# EAGLE schematic filter (EAGLE 8.6.0)
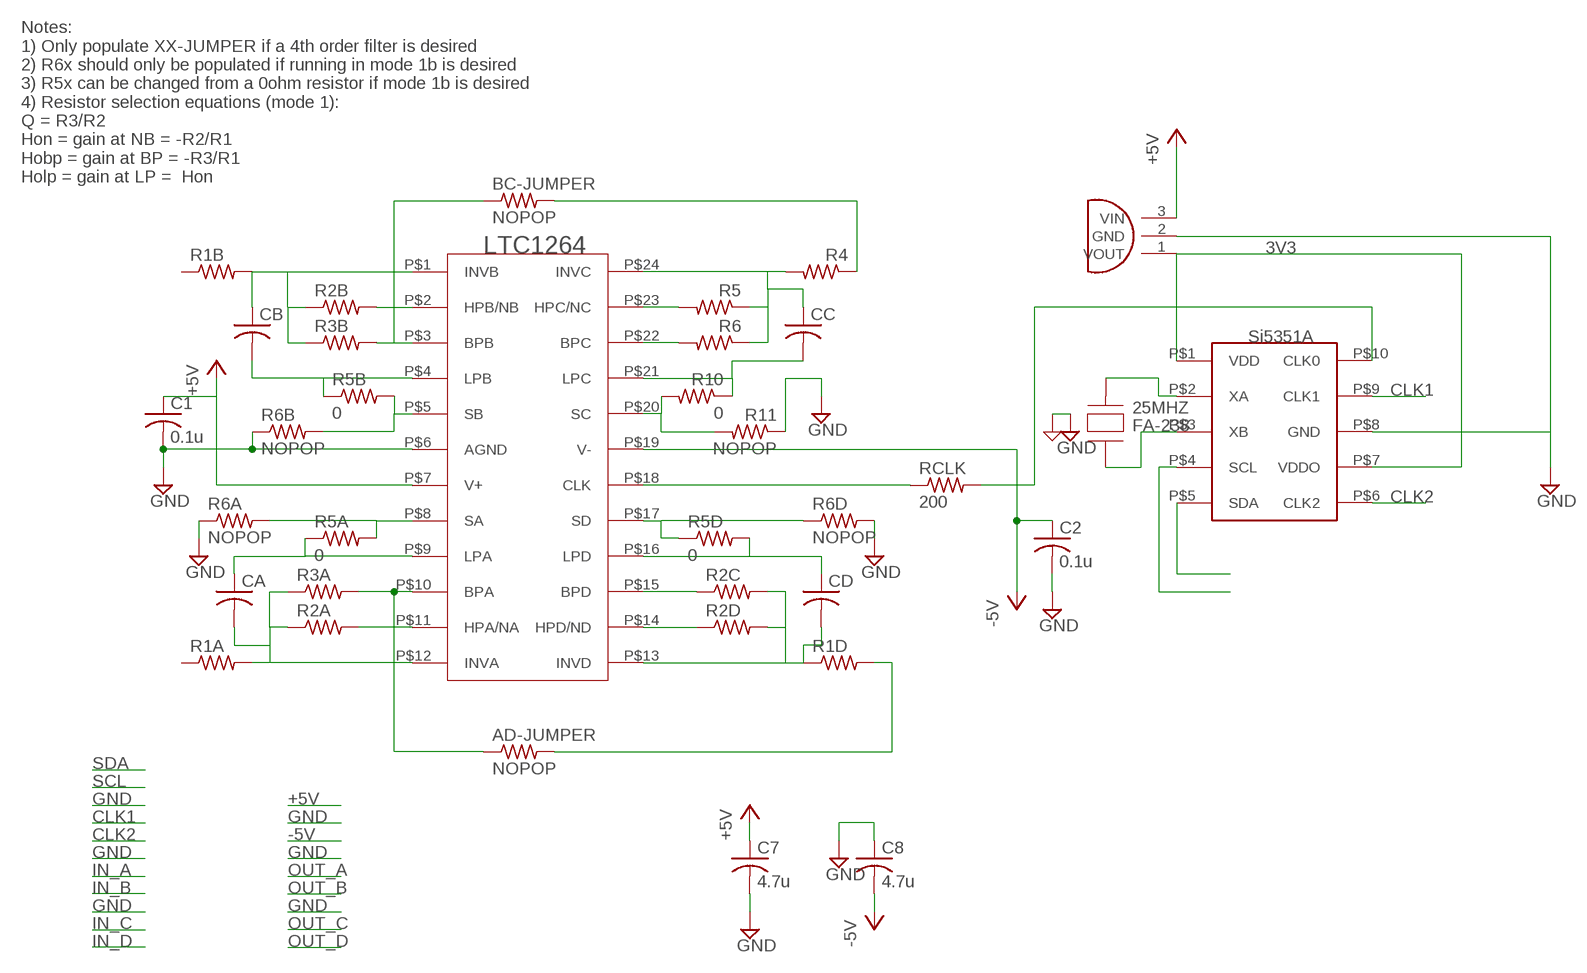
[diagram p0: schematic, sheet 1]

## Parts
25MHZ  FA-238  [FA-238]
AD-JUMPER  NOPOP  R-US_R2010  [R2010]
BC-JUMPER  NOPOP  R-US_R2010  [R2010]
C1  0.1u  C-USC2012  [C2012]
C2  0.1u  C-USC2012  [C2012]
C7  4.7u  C-USC2012  [C2012]
C8  4.7u  C-USC2012  [C2012]
CA  C-USC2012  [C2012]
CB  C-USC2012  [C2012]
CC  C-USC2012  [C2012]
CD  C-USC2012  [C2012]
R1A  R-US_R2010  [R2010]
R1B  R-US_R2010  [R2010]
R1D  R-US_R2010  [R2010]
R2A  R-US_R2010  [R2010]
R2B  R-US_R2010  [R2010]
R2C  R-US_R2010  [R2010]
R2D  R-US_R2010  [R2010]
R3A  R-US_R2010  [R2010]
R3B  R-US_R2010  [R2010]
R4  R-US_R2010  [R2010]
R5  R-US_R2010  [R2010]
R5A  0  R-US_R2010  [R2010]
R5B  0  R-US_R2010  [R2010]
R5D  0  R-US_R2010  [R2010]
R6  R-US_R2010  [R2010]
R6A  NOPOP  R-US_R2010  [R2010]
R6B  NOPOP  R-US_R2010  [R2010]
R6D  NOPOP  R-US_R2010  [R2010]
R10  0  R-US_R2010  [R2010]
R11  NOPOP  R-US_R2010  [R2010]
RCLK  200  R-US_R2010  [R2010]
U$1  LTC1264  [DIP-24]
U$2  SI5351A  [MSOP-10]
U$3  L78L33ACZ  [TO-92]

## Nets
3V3: U$2.P$1(VDD) U$2.P$7(VDDO) U$3.1(VOUT)
+5V: U$1.P$7(V+) U$3.3(VIN)
-5V: U$1.P$19(V-)
CLK1: U$2.P$9(CLK1)
CLK2: U$2.P$6(CLK2)
GND: C1.2 R6A.1 R6B.1 R6D.2 R11.1 U$1.P$6(AGND) U$2.P$8(GND) U$3.2(GND)
N$1: C7.2
N$2: R2B.2 U$1.P$2(HPB/NB)
N$3: RCLK.2 U$2.P$10(CLK0)
N$4: U$2.P$5(SDA)
N$5: U$2.P$4(SCL)
N$6: BC-JUMPER.1 R3B.2 U$1.P$3(BPB)
N$7: CB.2 R5B.1 U$1.P$4(LPB)
N$8: R5B.2 R6B.2 U$1.P$5(SB)
N$9: C8.1
N$10: R5.2
N$11: R6.2
N$12: CC.2 R10.1
N$13: R10.2 R11.2 U$1.P$20(SC)
N$14: BC-JUMPER.2 R4.1
N$15: AD-JUMPER.1 R3A.2 U$1.P$10(BPA)
N$16: R2A.2 U$1.P$11(HPA/NA)
N$17: C7.1
N$18: CA.1 R5A.1 U$1.P$9(LPA)
N$19: R5A.2 R6A.2 U$1.P$8(SA)
N$20: CB.1 R1B.2 R2B.1 R3B.1 U$1.P$1(INVB)
N$21: CC.1 R4.2 R5.1 R6.1
N$22: R5D.1 R6D.1 U$1.P$17(SD)
N$23: CD.1 R5D.2 U$1.P$16(LPD)
N$24: R2C.1 U$1.P$15(BPD)
N$25: R2D.1 U$1.P$14(HPD/ND)
N$26: CD.2 R1D.1 R2C.2 R2D.2 U$1.P$13(INVD)
N$27: 25MHZ.P$4(XA) U$2.P$2(XA)
N$28: 25MHZ.P$2(XB) U$2.P$3(XB)
N$29: 25MHZ.P$1(GND) 25MHZ.P$3(GND)
N$30: AD-JUMPER.2 R1D.2
N$31: RCLK.1 U$1.P$18(CLK)
N$32: CA.2 R1A.2 R2A.1 R3A.1 U$1.P$12(INVA)
N$33: C8.2
Unconnected: C1.1 C2.1 C2.2 R1A.1 R1B.1 U$1.P$21(LPC) U$1.P$22(BPC) U$1.P$23(HPC/NC) U$1.P$24(INVC)

## Notes on the sheet
- Notes: 
  1) Only populate XX-JUMPER if a 4th order filter is desired
  2) R6x should only be populated if running in mode 1b is desired
  3) R5x can be changed from a 0ohm resistor if mode 1b is desired
  4) Resistor selection equations (mode 1):
  Q = R3/R2
  Hon = gain at NB = -R2/R1
  Hobp = gain at BP = -R3/R1
  Holp = gain at LP =  Hon

## Library data of the parts
25MHZ = ARVP:FA-238
AD-JUMPER BC-JUMPER R1A R1B R1D R2A R2B R2C R2D R3A R3B R4 R5 R5A R5B R5D R6 R6A R6B R6D R10 R11 RCLK = resistor:R-US_: RESISTOR, American symbol
C1 C2 C7 C8 CA CB CC CD = rcl:C-US: CAPACITOR, American symbol; SPICEPREFIX: C
U$1 = ARVP:LTC1264
U$2 = ARVP:SI5351A
U$3 = ARVP:L78L33ACZ